# EAGLE design gomasuno (EAGLE 7.3.0)
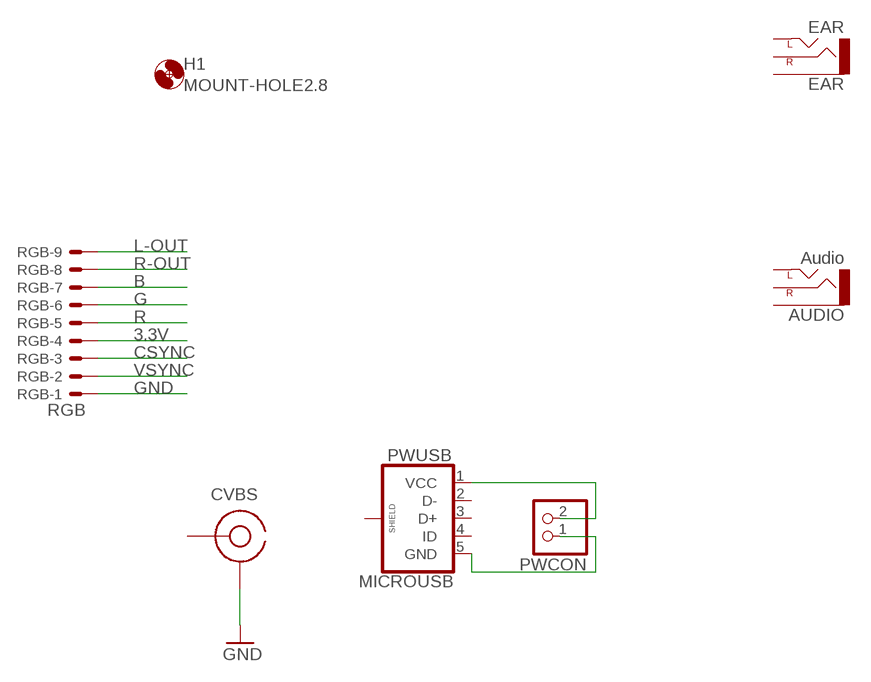
[diagram p0: schematic, sheet 1]

## Parts
AUDIO  Audio  AUDIO-JACKPTH  [AUDIO-JACK]
CVBS  RCA  [RCA]
EAR  EAR  AUDIO-JACKPTH  [AUDIO-JACK]
H1  MOUNT-HOLE2.8  [2,8]
PWCON  PINHD-1X2  [1X02]
PWUSB  MICROUSB  [MICRO_USB_1PRIMARY]
RGB  RGB  53048-09  [53048-09]

## Nets
3.3V: RGB.4
B: RGB.7
CSYNC: RGB.3
G: RGB.6
GND: CVBS.GND PWCON.1 PWUSB.5(GND) RGB.1
L-OUT: RGB.9
N$12: PWCON.2 PWUSB.1(VCC)
R: RGB.5
R-OUT: RGB.8
VSYNC: RGB.2
Unconnected: AUDIO.RING(RIGHT) AUDIO.SLEEVE AUDIO.TIP(LEFT) CVBS.SIG EAR.RING(RIGHT) EAR.SLEEVE EAR.TIP(LEFT) PWUSB.2(D-) PWUSB.3(D+) PWUSB.4(ID) PWUSB.6(SHIELD)

## Library data of the parts
AUDIO EAR = SparkFun-Connectors:AUDIO-JACK: 3.5mm Audio Jack Simple 3.5mm common PCB mount audio jack. SKU: PRT-08032
CVBS = uzebox:RCA: RCA jack
H1 = holes:MOUNT-HOLE: MOUNTING HOLE with drill center marker
PWCON = pinhead:PINHD-1X2: PIN HEADER
PWUSB = zxuno_rev_mcleod:MICROUSB
RGB = con-molex:53?-09: CONNECTOR wire to board 1.25 mm (.049 inch) pitch header; MPN: 53048-0910; OC_FARNELL: 1012239; OC_NEWARK: 98K9837

## Board
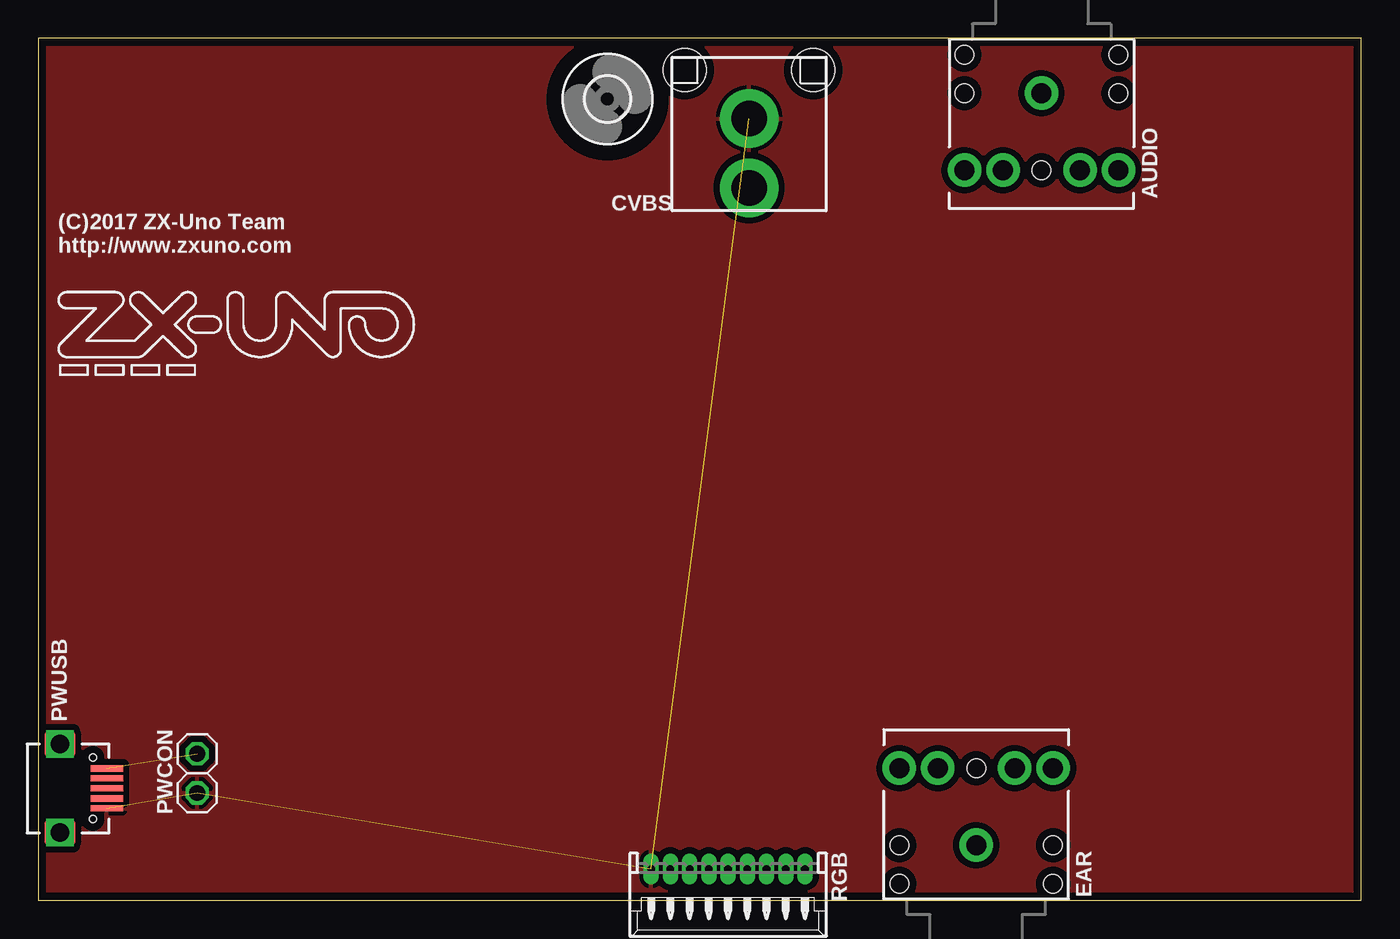
[diagram p1: board, top side]
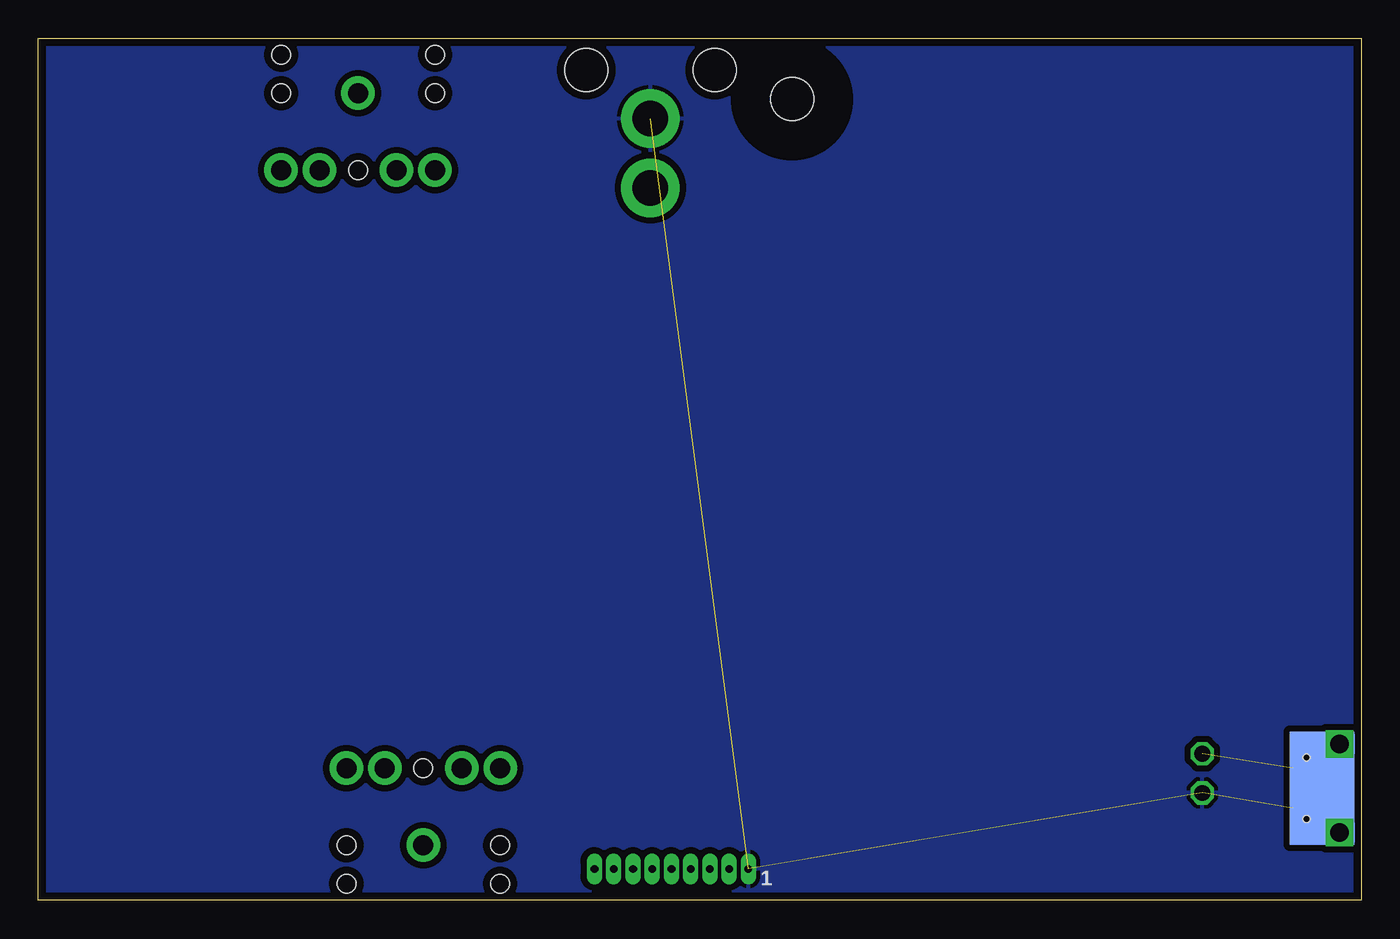
[diagram p2: board, bottom side, seen from below]

Size 85.98 x 56.01 mm. Coordinates in mm from the lower left corner, seen from the top.
Outline: 0,0 85.98,0 85.98,56.01 0,56.01 0,0
Copper layers (1*16): Top 0.035mm / dielectric 1.5mm / Bottom 0.035mm
Design rules "EagleRules": minimum track width 7mil, minimum drill 12mil, track to track 7mil, track to pad 7mil, pad to pad 7mil, via to via 7mil, smd to smd 0mil, copper to edge 20mil, drill to drill 10mil, minimum pad ring 10mil, minimum via ring 6mil, stop-mask expansion 2mil, vias tented up to drill 25mil, thermal gap 10mil

### Footprints (pad centres in the part's own frame; a part is rotated, then mirrored left to right if it is on the bottom)
AUDIO-JACK = drill 1.3 pad 2.184: RING 5,5; RSH 5,2.5; SLEEVE 0,0; TIP 5,-5; TSH 5,-2.5 | hole 1.2: 0,5; -2.5,5; -2.5,-5; 0,-5; 5,0
RCA = drill 2.3 pad 3.81: GND 0,0; SIG 0,-4.5 | hole 2.8: -4.175,3.15; 4.175,3.15
2,8 = hole 2.8: 0,0
1X02 = drill 1.016 octagon: 1 -1.27,0; 2 1.27,0
MICRO_USB_1PRIMARY = smd 0.406 x 2.108: 1 -1.295,0.381; 2 -0.66,0.381; 3 0,0.381; 4 0.66,0.381; 5 1.295,0.381 | smd 7.366 x 4.191 bottom: 6 0,-1.524 | drill 1.194 pad 1.538 square: 7 -2.87,-2.667; 8 2.87,-2.667 | hole 0.457: -2.007,-0.533; 2.007,-0.533
53048-09 = drill 0.5 pad 0.698 long: 1 5,-1.25; 2 3.75,-1.25; 3 2.5,-1.25; 4 1.25,-1.25; 5 0,-1.25; 6 -1.25,-1.25; 7 -2.5,-1.25; 8 -3.75,-1.25; 9 -5,-1.25

### Placement (x,y rotation side)
AUDIO  65.21,52.45 270 top
CVBS  46.2,50.8 0 top
EAR  60.96,3.59 90 top
H1  36.99,52.07 0 top
PWCON  10.32,8.26 90 top
PWUSB  4.06,7.28 270 top
RGB  44.83,0.79 180 top

### Tracks (layer width: path | path; a pad name or v marks a point on that pad's centre or on a via)
GND  (3 unrouted)
  pour Bottom (isolate 0.406): 0.06,55.82 85.88,55.82 85.88,0.16 0.16,0.16
  pour Top (isolate 0.406): 0.2,0.17 85.88,0.17 85.88,55.81 0.2,55.81
N$12  (1 unrouted)

### Text on the board
tPlace: (C)2017 ZX-Uno Team / http://www.zxuno.com
bNames: 1
_tNames: C36 | R6 | J10 | D4 | R7 | J11 | D5 | J12 | C34 | R23 | AUDIO | RST | CVBS | R4 | R24 | U1 | R22 | C4 | C3 | C35 | U7 | R32 | L2 | U2 | C26 | L1 | U6 | C27 | C31 | C30 | R31 | U3 | U4 | R30 | R21 | R14 | J16 | JOY | C28 | C8 | C7 | R18 | JTAG | C29 | T1 | R29 | R15 | R19 | R27 | R5 | L3 | PWUSB | C33 | R16 | R13 | R10 | C6 | C1 | R12 | R1 | R8 | R20 | R2 | R28 | R9 | PWCON | SW | R17 | R3 | C2 | C32 | D3 | C5 | D1 | RGB | EAR | R11 | PS/2 | D2 | Y1 | Y2
_bNames: C25 | C14 | C9 | C10 | C15 | C23 | C24 | C16 | C13 | C22 | C11 | C17 | C21 | U5 | C20 | C19 | C18 | C12 | R25 | R26
_tValues: JTAG | RGB | EAR